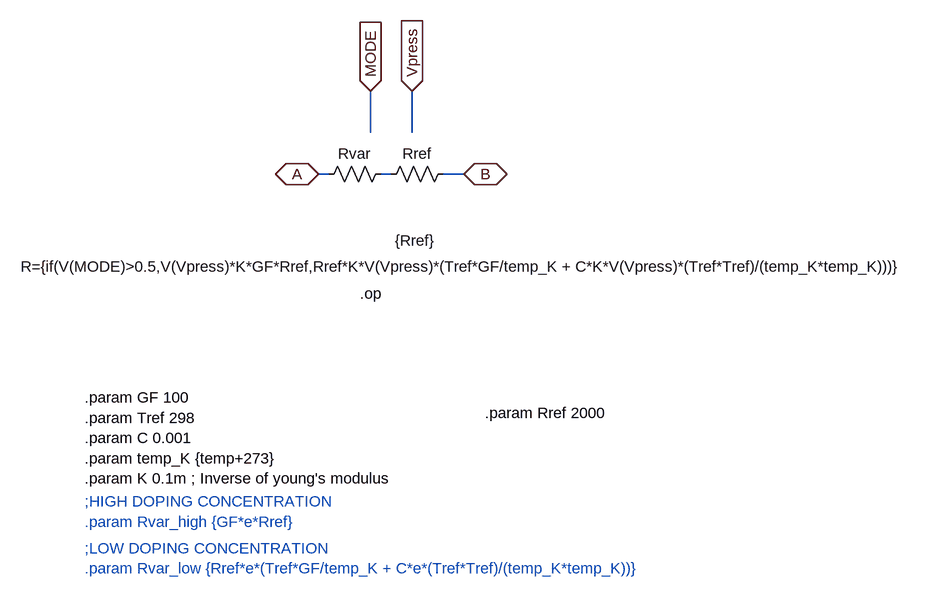
[diagram p0: schematic SENSOR_RES.asc]
SENSOR_RES.asc, the LTspice schematic file:
Version 4
SHEET 1 1248 1508
WIRE 400 272 400 208
WIRE 464 272 464 208
WIRE 336 336 320 336
WIRE 432 336 416 336
WIRE 544 336 512 336
FLAG 464 208 Vpress
IOPIN 464 208 In
FLAG 400 208 MODE
IOPIN 400 208 In
FLAG 320 336 A
IOPIN 320 336 BiDir
FLAG 544 336 B
IOPIN 544 336 BiDir
SYMBOL res 432 320 R90
WINDOW 0 0 56 VBottom 2
WINDOW 3 143 -113 VTop 2
SYMATTR InstName Rvar
SYMATTR Value R={if(V(MODE)>0.5,V(Vpress)*K*GF*Rref,Rref*K*V(Vpress)*(Tref*GF/temp_K + C*K*V(Vpress)*(Tref*Tref)/(temp_K*temp_K)))}
SYMBOL res 528 320 R90
WINDOW 0 0 56 VBottom 2
WINDOW 3 103 59 VTop 2
SYMATTR InstName Rref
SYMATTR Value {Rref}
TEXT -40 680 Left 2 !.param GF 100\n.param Tref 298\n.param C 0.001\n.param temp_K {temp+273}\n.param K 0.1m ; Inverse of young's modulus
TEXT -40 912 Left 2 ;;LOW DOPING CONCENTRATION\n.param Rvar_low {Rref*e*(Tref*GF/temp_K + C*e*(Tref*Tref)/(temp_K*temp_K))}
TEXT -40 840 Left 2 ;;HIGH DOPING CONCENTRATION\n.param Rvar_high {GF*e*Rref}
TEXT 576 704 Left 2 !.param Rref 2000
TEXT 384 520 Left 2 !.op

The netlist it stands for:
* SENSOR_RES.asc
Rvar N001 A R={if(V(MODE)>0.5,V(Vpress)*K*GF*Rref,Rref*K*V(Vpress)*(Tref*GF/temp_K + C*K*V(Vpress)*(Tref*Tref)/(temp_K*temp_K)))}
Rref B N001 {Rref}
.param GF 100
.param Tref 298
.param C 0.001
.param temp_K {temp+273}
.param K 0.1m ; Inverse of young's modulus
* ;LOW DOPING CONCENTRATION
* .param Rvar_low {Rref*e*(Tref*GF/temp_K + C*e*(Tref*Tref)/(temp_K*temp_K))}
* ;HIGH DOPING CONCENTRATION
* .param Rvar_high {GF*e*Rref}
.param Rref 2000
.op
.backanno
.end